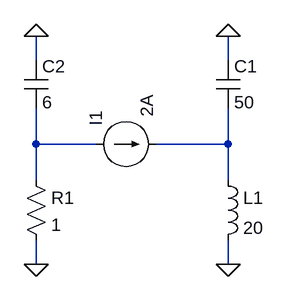
[diagram p0: schematic ltspice_pred.asc]
ltspice_pred.asc, the LTspice schematic file:
Version 4
SHEET 1 880 680
WIRE -48 128 -48 96
WIRE 208 128 208 96
WIRE -48 240 -48 192
WIRE 32 240 -48 240
WIRE 208 240 208 192
WIRE 208 240 112 240
WIRE -48 288 -48 240
WIRE 208 288 208 240
WIRE -48 400 -48 368
WIRE 208 400 208 368
FLAG 208 96 0
FLAG 208 400 0
FLAG -48 400 0
FLAG -48 96 0
SYMBOL cap 192 128 R0
SYMATTR InstName C1
SYMATTR Value 50
SYMBOL current 32 240 R270
WINDOW 123 0 0 Left 0
WINDOW 39 0 0 Left 0
WINDOW 3 36 68 Left 2
SYMATTR Value 2A
SYMATTR InstName I1
SYMBOL ind 192 272 R0
SYMATTR InstName L1
SYMATTR Value 20
SYMBOL res -64 272 R0
SYMATTR InstName R1
SYMATTR Value 1
SYMBOL cap -64 128 R0
SYMATTR InstName C2
SYMATTR Value 6

The netlist it stands for:
* ltspice_pred.asc
C1 0 N002 50
I1 N001 N002 2A
L1 N002 0 20
R1 N001 0 1
C2 0 N001 6
.backanno
.end